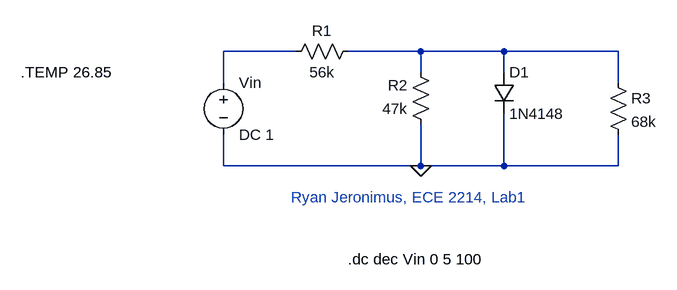
[diagram p0: schematic Draft16.asc]
Draft16.asc, the LTspice schematic file:
Version 4
SHEET 1 880 680
WIRE 144 80 32 80
WIRE 336 80 224 80
WIRE 464 80 336 80
WIRE 640 80 464 80
WIRE 336 112 336 80
WIRE 464 112 464 80
WIRE 32 128 32 80
WIRE 640 128 640 80
WIRE 32 256 32 208
WIRE 336 256 336 192
WIRE 336 256 32 256
WIRE 464 256 464 176
WIRE 464 256 336 256
WIRE 640 256 640 208
WIRE 640 256 464 256
FLAG 336 256 0
SYMBOL voltage 32 112 R0
SYMATTR InstName Vin
SYMATTR Value DC 1
SYMBOL res 352 208 R180
WINDOW 0 36 76 Left 2
WINDOW 3 36 40 Left 2
SYMATTR InstName R2
SYMATTR Value 47k
SYMBOL diode 448 112 R0
SYMATTR InstName D1
SYMATTR Value 1N4148
SYMBOL res 240 64 R90
WINDOW 0 0 56 VBottom 2
WINDOW 3 32 56 VTop 2
SYMATTR InstName R1
SYMATTR Value 56k
SYMBOL res 624 112 R0
SYMATTR InstName R3
SYMATTR Value 68k
TEXT 136 304 Left 2 ;Ryan Jeronimus, ECE 2214, Lab1
TEXT 224 400 Left 2 !.dc dec Vin 0 5 100
TEXT -280 112 Left 2 !.TEMP 26.85

The netlist it stands for:
* Draft16.asc
Vin N001 0 DC 1
R2 0 N002 47k
D1 N002 0 1N4148
R1 N002 N001 56k
R3 N002 0 68k
.model D D
.lib standard.dio
* Ryan Jeronimus, ECE 2214, Lab1
.dc dec Vin 0 5 100
.TEMP 26.85
.backanno
.end